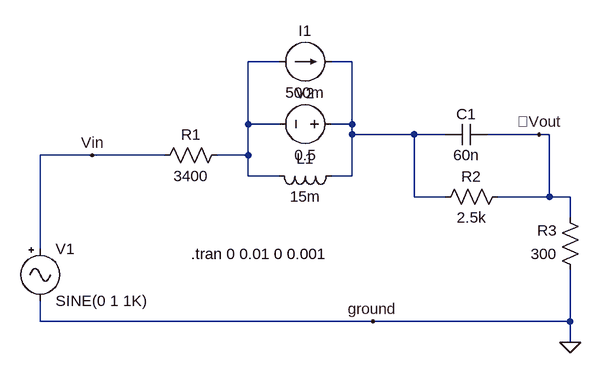
[diagram p0: schematic R__I_V_L__C_R__R.asc]
R__I_V_L__C_R__R.asc, the LTspice schematic file:
Version 4
SHEET 1 880 680
WIRE 400 -32 352 -32
WIRE 512 -32 480 -32
WIRE 352 64 352 -32
WIRE 400 64 352 64
WIRE 512 64 512 -32
WIRE 512 64 480 64
WIRE 512 80 512 64
WIRE 608 80 512 80
WIRE 656 80 608 80
WIRE 800 80 720 80
WIRE 816 80 800 80
WIRE 112 112 32 112
WIRE 224 112 112 112
WIRE 352 112 352 64
WIRE 352 112 304 112
WIRE 352 144 352 112
WIRE 400 144 352 144
WIRE 512 144 512 80
WIRE 512 144 480 144
WIRE 608 176 608 80
WIRE 656 176 608 176
WIRE 816 176 816 80
WIRE 816 176 736 176
WIRE 848 176 816 176
WIRE 848 208 848 176
WIRE 32 256 32 112
WIRE 32 368 32 336
WIRE 544 368 32 368
WIRE 848 368 848 288
WIRE 848 368 544 368
WIRE 848 400 848 368
FLAG 848 400 0
FLAG 112 112 Vin
FLAG 800 80 Vout
FLAG 544 368 ground
SYMBOL Misc/signal 32 240 R0
SYMATTR InstName V1
SYMBOL res 320 96 R90
WINDOW 0 0 56 VBottom 2
WINDOW 3 32 56 VTop 2
SYMATTR InstName R1
SYMATTR Value 3400
SYMBOL current 400 -32 R270
WINDOW 0 32 40 VTop 2
WINDOW 3 -32 40 VBottom 2
SYMATTR InstName I1
SYMATTR Value 500m
SYMBOL voltage 496 64 R90
WINDOW 0 -32 56 VBottom 2
WINDOW 3 32 56 VTop 2
SYMATTR InstName V2
SYMATTR Value 0.5
SYMBOL ind 496 128 R90
WINDOW 0 5 56 VBottom 2
WINDOW 3 32 56 VTop 2
SYMATTR InstName L1
SYMATTR Value 15m
SYMBOL cap 720 64 R90
WINDOW 0 0 32 VBottom 2
WINDOW 3 32 32 VTop 2
SYMATTR InstName C1
SYMATTR Value 60n
SYMBOL res 752 160 R90
WINDOW 0 0 56 VBottom 2
WINDOW 3 32 56 VTop 2
SYMATTR InstName R2
SYMATTR Value 2.5k
SYMBOL res 864 304 R180
WINDOW 0 36 76 Left 2
WINDOW 3 36 40 Left 2
SYMATTR InstName R3
SYMATTR Value 300
TEXT 264 264 Left 2 !.tran 0 0.01 0 0.001

The netlist it stands for:
* R__I_V_L__C_R__R.asc
V1 Vin 0 SINE(0 1 1K)
R1 N001 Vin 3400
I1 N001 N002 500m
V2 N002 N001 0.5
L1 N002 N001 15m
C1 Vout N002 60n
R2 Vout N002 2.5k
R3 0 Vout 300
.tran 0 0.01 0 0.001
.backanno
.end